# Altium schematic sheet RK3399_LPDDR4_Pins.SchDoc
size A3; SheetNumber: 2; SheetTotal: 6
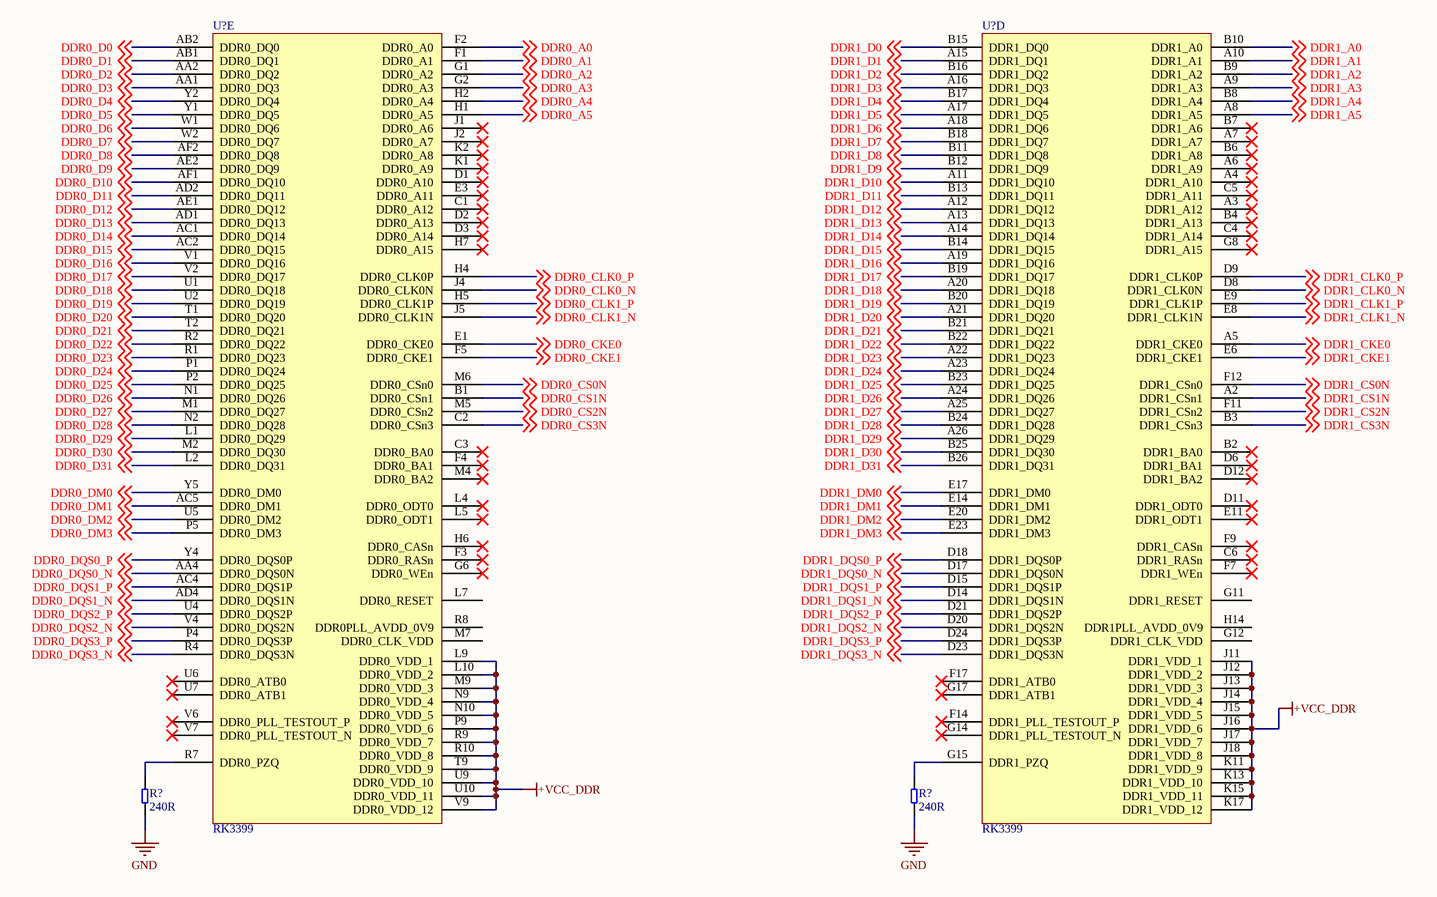
[diagram p0: RK3399_LPDDR4_Pins.SchDoc]

## Parts
(Parts that share a designator on the sheet are numbered #1, #2 ... from top to bottom, then left to right.)
R?#1  240R  [RES_0201]
R?#2  240R  [RES_0201]
U?#1  RK3399  [BGA828_RK3399]  (part E of 24)
U?#2  RK3399  [BGA828_RK3399]  (part D of 24)

## Nets
+VCC_DDR: U?#1.L9(DDR0_VDD_1) U?#1.L10(DDR0_VDD_2) U?#1.M9(DDR0_VDD_3) U?#1.N9(DDR0_VDD_4) U?#1.N10(DDR0_VDD_5) U?#1.P9(DDR0_VDD_6) U?#1.R9(DDR0_VDD_7) U?#1.R10(DDR0_VDD_8) U?#1.T9(DDR0_VDD_9) U?#1.U9(DDR0_VDD_10) U?#1.U10(DDR0_VDD_11) U?#1.V9(DDR0_VDD_12) U?#2.J11(DDR1_VDD_1) U?#2.J12(DDR1_VDD_2) U?#2.J13(DDR1_VDD_3) U?#2.J14(DDR1_VDD_4) U?#2.J15(DDR1_VDD_5) U?#2.J16(DDR1_VDD_6) U?#2.J17(DDR1_VDD_7) U?#2.J18(DDR1_VDD_8) U?#2.K11(DDR1_VDD_9) U?#2.K13(DDR1_VDD_10) U?#2.K15(DDR1_VDD_11) U?#2.K17(DDR1_VDD_12)
GND: R?#1.1 R?#2.1
DDR0_A0: U?#1.F2(DDR0_A0) ; off-sheet DDR0_A0
DDR0_A1: U?#1.F1(DDR0_A1) ; off-sheet DDR0_A1
DDR0_A2: U?#1.G1(DDR0_A2) ; off-sheet DDR0_A2
DDR0_A3: U?#1.G2(DDR0_A3) ; off-sheet DDR0_A3
DDR0_A4: U?#1.H2(DDR0_A4) ; off-sheet DDR0_A4
DDR0_A5: U?#1.H1(DDR0_A5) ; off-sheet DDR0_A5
DDR0_CKE0: U?#1.E1(DDR0_CKE0) ; off-sheet DDR0_CKE0
DDR0_CKE1: U?#1.F5(DDR0_CKE1) ; off-sheet DDR0_CKE1
DDR0_CLK0_N: U?#1.J4(DDR0_CLK0N) ; off-sheet DDR0_CLK0_N
DDR0_CLK0_P: U?#1.H4(DDR0_CLK0P) ; off-sheet DDR0_CLK0_P
DDR0_CLK1_N: U?#1.J5(DDR0_CLK1N) ; off-sheet DDR0_CLK1_N
DDR0_CLK1_P: U?#1.H5(DDR0_CLK1P) ; off-sheet DDR0_CLK1_P
DDR0_CS0N: U?#1.M6(DDR0_CSn0) ; off-sheet DDR0_CS0N
DDR0_CS1N: U?#1.B1(DDR0_CSn1) ; off-sheet DDR0_CS1N
DDR0_CS2N: U?#1.M5(DDR0_CSn2) ; off-sheet DDR0_CS2N
DDR0_CS3N: U?#1.C2(DDR0_CSn3) ; off-sheet DDR0_CS3N
DDR0_D0: U?#1.AB2(DDR0_DQ0) ; off-sheet DDR0_D0
DDR0_D1: U?#1.AB1(DDR0_DQ1) ; off-sheet DDR0_D1
DDR0_D2: U?#1.AA2(DDR0_DQ2) ; off-sheet DDR0_D2
DDR0_D3: U?#1.AA1(DDR0_DQ3) ; off-sheet DDR0_D3
DDR0_D4: U?#1.Y2(DDR0_DQ4) ; off-sheet DDR0_D4
DDR0_D5: U?#1.Y1(DDR0_DQ5) ; off-sheet DDR0_D5
DDR0_D6: U?#1.W1(DDR0_DQ6) ; off-sheet DDR0_D6
DDR0_D7: U?#1.W2(DDR0_DQ7) ; off-sheet DDR0_D7
DDR0_D8: U?#1.AF2(DDR0_DQ8) ; off-sheet DDR0_D8
DDR0_D9: U?#1.AE2(DDR0_DQ9) ; off-sheet DDR0_D9
DDR0_D10: U?#1.AF1(DDR0_DQ10) ; off-sheet DDR0_D10
DDR0_D11: U?#1.AD2(DDR0_DQ11) ; off-sheet DDR0_D11
DDR0_D12: U?#1.AE1(DDR0_DQ12) ; off-sheet DDR0_D12
DDR0_D13: U?#1.AD1(DDR0_DQ13) ; off-sheet DDR0_D13
DDR0_D14: U?#1.AC1(DDR0_DQ14) ; off-sheet DDR0_D14
DDR0_D15: U?#1.AC2(DDR0_DQ15) ; off-sheet DDR0_D15
DDR0_D16: U?#1.V1(DDR0_DQ16) ; off-sheet DDR0_D16
DDR0_D17: U?#1.V2(DDR0_DQ17) ; off-sheet DDR0_D17
DDR0_D18: U?#1.U1(DDR0_DQ18) ; off-sheet DDR0_D18
DDR0_D19: U?#1.U2(DDR0_DQ19) ; off-sheet DDR0_D19
DDR0_D20: U?#1.T1(DDR0_DQ20) ; off-sheet DDR0_D20
DDR0_D21: U?#1.T2(DDR0_DQ21) ; off-sheet DDR0_D21
DDR0_D22: U?#1.R2(DDR0_DQ22) ; off-sheet DDR0_D22
DDR0_D23: U?#1.R1(DDR0_DQ23) ; off-sheet DDR0_D23
DDR0_D24: U?#1.P1(DDR0_DQ24) ; off-sheet DDR0_D24
DDR0_D25: U?#1.P2(DDR0_DQ25) ; off-sheet DDR0_D25
DDR0_D26: U?#1.N1(DDR0_DQ26) ; off-sheet DDR0_D26
DDR0_D27: U?#1.M1(DDR0_DQ27) ; off-sheet DDR0_D27
DDR0_D28: U?#1.N2(DDR0_DQ28) ; off-sheet DDR0_D28
DDR0_D29: U?#1.L1(DDR0_DQ29) ; off-sheet DDR0_D29
DDR0_D30: U?#1.M2(DDR0_DQ30) ; off-sheet DDR0_D30
DDR0_D31: U?#1.L2(DDR0_DQ31) ; off-sheet DDR0_D31
DDR0_DM0: U?#1.Y5(DDR0_DM0) ; off-sheet DDR0_DM0
DDR0_DM1: U?#1.AC5(DDR0_DM1) ; off-sheet DDR0_DM1
DDR0_DM2: U?#1.U5(DDR0_DM2) ; off-sheet DDR0_DM2
DDR0_DM3: U?#1.P5(DDR0_DM3) ; off-sheet DDR0_DM3
DDR0_DQS0_N: U?#1.AA4(DDR0_DQS0N) ; off-sheet DDR0_DQS0_N
DDR0_DQS0_P: U?#1.Y4(DDR0_DQS0P) ; off-sheet DDR0_DQS0_P
DDR0_DQS1_N: U?#1.AD4(DDR0_DQS1N) ; off-sheet DDR0_DQS1_N
DDR0_DQS1_P: U?#1.AC4(DDR0_DQS1P) ; off-sheet DDR0_DQS1_P
DDR0_DQS2_N: U?#1.V4(DDR0_DQS2N) ; off-sheet DDR0_DQS2_N
DDR0_DQS2_P: U?#1.U4(DDR0_DQS2P) ; off-sheet DDR0_DQS2_P
DDR0_DQS3_N: U?#1.R4(DDR0_DQS3N) ; off-sheet DDR0_DQS3_N
DDR0_DQS3_P: U?#1.P4(DDR0_DQS3P) ; off-sheet DDR0_DQS3_P
DDR1_A0: U?#2.B10(DDR1_A0) ; off-sheet DDR1_A0
DDR1_A1: U?#2.A10(DDR1_A1) ; off-sheet DDR1_A1
DDR1_A2: U?#2.B9(DDR1_A2) ; off-sheet DDR1_A2
DDR1_A3: U?#2.A9(DDR1_A3) ; off-sheet DDR1_A3
DDR1_A4: U?#2.B8(DDR1_A4) ; off-sheet DDR1_A4
DDR1_A5: U?#2.A8(DDR1_A5) ; off-sheet DDR1_A5
DDR1_CKE0: U?#2.A5(DDR1_CKE0) ; off-sheet DDR1_CKE0
DDR1_CKE1: U?#2.E6(DDR1_CKE1) ; off-sheet DDR1_CKE1
DDR1_CLK0_N: U?#2.D8(DDR1_CLK0N) ; off-sheet DDR1_CLK0_N
DDR1_CLK0_P: U?#2.D9(DDR1_CLK0P) ; off-sheet DDR1_CLK0_P
DDR1_CLK1_N: U?#2.E8(DDR1_CLK1N) ; off-sheet DDR1_CLK1_N
DDR1_CLK1_P: U?#2.E9(DDR1_CLK1P) ; off-sheet DDR1_CLK1_P
DDR1_CS0N: U?#2.F12(DDR1_CSn0) ; off-sheet DDR1_CS0N
DDR1_CS1N: U?#2.A2(DDR1_CSn1) ; off-sheet DDR1_CS1N
DDR1_CS2N: U?#2.F11(DDR1_CSn2) ; off-sheet DDR1_CS2N
DDR1_CS3N: U?#2.B3(DDR1_CSn3) ; off-sheet DDR1_CS3N
DDR1_D0: U?#2.B15(DDR1_DQ0) ; off-sheet DDR1_D0
DDR1_D1: U?#2.A15(DDR1_DQ1) ; off-sheet DDR1_D1
DDR1_D2: U?#2.B16(DDR1_DQ2) ; off-sheet DDR1_D2
DDR1_D3: U?#2.A16(DDR1_DQ3) ; off-sheet DDR1_D3
DDR1_D4: U?#2.B17(DDR1_DQ4) ; off-sheet DDR1_D4
DDR1_D5: U?#2.A17(DDR1_DQ5) ; off-sheet DDR1_D5
DDR1_D6: U?#2.A18(DDR1_DQ6) ; off-sheet DDR1_D6
DDR1_D7: U?#2.B18(DDR1_DQ7) ; off-sheet DDR1_D7
DDR1_D8: U?#2.B11(DDR1_DQ8) ; off-sheet DDR1_D8
DDR1_D9: U?#2.B12(DDR1_DQ9) ; off-sheet DDR1_D9
DDR1_D10: U?#2.A11(DDR1_DQ10) ; off-sheet DDR1_D10
DDR1_D11: U?#2.B13(DDR1_DQ11) ; off-sheet DDR1_D11
DDR1_D12: U?#2.A12(DDR1_DQ12) ; off-sheet DDR1_D12
DDR1_D13: U?#2.A13(DDR1_DQ13) ; off-sheet DDR1_D13
DDR1_D14: U?#2.A14(DDR1_DQ14) ; off-sheet DDR1_D14
DDR1_D15: U?#2.B14(DDR1_DQ15) ; off-sheet DDR1_D15
DDR1_D16: U?#2.A19(DDR1_DQ16) ; off-sheet DDR1_D16
DDR1_D17: U?#2.B19(DDR1_DQ17) ; off-sheet DDR1_D17
DDR1_D18: U?#2.A20(DDR1_DQ18) ; off-sheet DDR1_D18
DDR1_D19: U?#2.B20(DDR1_DQ19) ; off-sheet DDR1_D19
DDR1_D20: U?#2.A21(DDR1_DQ20) ; off-sheet DDR1_D20
DDR1_D21: U?#2.B21(DDR1_DQ21) ; off-sheet DDR1_D21
DDR1_D22: U?#2.B22(DDR1_DQ22) ; off-sheet DDR1_D22
DDR1_D23: U?#2.A22(DDR1_DQ23) ; off-sheet DDR1_D23
DDR1_D24: U?#2.A23(DDR1_DQ24) ; off-sheet DDR1_D24
DDR1_D25: U?#2.B23(DDR1_DQ25) ; off-sheet DDR1_D25
DDR1_D26: U?#2.A24(DDR1_DQ26) ; off-sheet DDR1_D26
DDR1_D27: U?#2.A25(DDR1_DQ27) ; off-sheet DDR1_D27
DDR1_D28: U?#2.B24(DDR1_DQ28) ; off-sheet DDR1_D28
DDR1_D29: U?#2.A26(DDR1_DQ29) ; off-sheet DDR1_D29
DDR1_D30: U?#2.B25(DDR1_DQ30) ; off-sheet DDR1_D30
DDR1_D31: U?#2.B26(DDR1_DQ31) ; off-sheet DDR1_D31
DDR1_DM0: U?#2.E17(DDR1_DM0) ; off-sheet DDR1_DM0
DDR1_DM1: U?#2.E14(DDR1_DM1) ; off-sheet DDR1_DM1
DDR1_DM2: U?#2.E20(DDR1_DM2) ; off-sheet DDR1_DM2
DDR1_DM3: U?#2.E23(DDR1_DM3) ; off-sheet DDR1_DM3
DDR1_DQS0_N: U?#2.D17(DDR1_DQS0N) ; off-sheet DDR1_DQS0_N
DDR1_DQS0_P: U?#2.D18(DDR1_DQS0P) ; off-sheet DDR1_DQS0_P
DDR1_DQS1_N: U?#2.D14(DDR1_DQS1N) ; off-sheet DDR1_DQS1_N
DDR1_DQS1_P: U?#2.D15(DDR1_DQS1P) ; off-sheet DDR1_DQS1_P
DDR1_DQS2_N: U?#2.D20(DDR1_DQS2N) ; off-sheet DDR1_DQS2_N
DDR1_DQS2_P: U?#2.D21(DDR1_DQS2P) ; off-sheet DDR1_DQS2_P
DDR1_DQS3_N: U?#2.D23(DDR1_DQS3N) ; off-sheet DDR1_DQS3_N
DDR1_DQS3_P: U?#2.D24(DDR1_DQS3P) ; off-sheet DDR1_DQS3_P
NetR?#1_2: R?#1.2 U?#1.R7(DDR0_PZQ)
NetR?#2_2: R?#2.2 U?#2.G15(DDR1_PZQ)

Not connected (* = marked no-connect by the designer): U?#1 C1(DDR0_A12)* C3(DDR0_BA0)* D1(DDR0_A10)* D2(DDR0_A13)* D3(DDR0_A14)* E3(DDR0_A11)* F3(DDR0_RASn)* F4(DDR0_BA1)* G6(DDR0_WEn)* H6(DDR0_CASn)* H7(DDR0_A15)* J1(DDR0_A6)* J2(DDR0_A7)* K1(DDR0_A9)* K2(DDR0_A8)* L4(DDR0_ODT0)* L5(DDR0_ODT1)* L7(DDR0_RESET) M4(DDR0_BA2)* M7(DDR0_CLK_VDD) R8(DDR0PLL_AVDD_0V9) U6(DDR0_ATB0)* U7(DDR0_ATB1)* V6(DDR0_PLL_TESTOUT_P)* V7(DDR0_PLL_TESTOUT_N)*; U?#2 A3(DDR1_A12)* A4(DDR1_A10)* A6(DDR1_A9)* A7(DDR1_A7)* B2(DDR1_BA0)* B4(DDR1_A13)* B6(DDR1_A8)* B7(DDR1_A6)* C4(DDR1_A14)* C5(DDR1_A11)* C6(DDR1_RASn)* D6(DDR1_BA1)* D11(DDR1_ODT0)* D12(DDR1_BA2)* E11(DDR1_ODT1)* F7(DDR1_WEn)* F9(DDR1_CASn)* F14(DDR1_PLL_TESTOUT_P)* F17(DDR1_ATB0)* G8(DDR1_A15)* G11(DDR1_RESET) G12(DDR1_CLK_VDD) G14(DDR1_PLL_TESTOUT_N)* G17(DDR1_ATB1)* H14(DDR1PLL_AVDD_0V9)

## Library data of the parts
R?#1 R?#2 = RES_240R-0.05W-1%-0201: 240 Ohms ±1% 0.05W, 1/20W Chip Resistor 0201 (0603 Metric) Thick Film /; Manufacturer: Yageo; Manufacturer Part Number: RC0201FR-07240RL; Case/Package: 0201; Supplier-1: Digikey
U?#1 U?#2 = IC_RK3399-FCBGA828: RK3399 is a low power, high performance processor for computing, personal mobile.; Manufacturer: Rockchip; Manufacturer Part Number: RK3399; Case/Package: FCBGA828; Supplier-1: Rockchip